# Altium project 智能温控风扇.PrjPCB
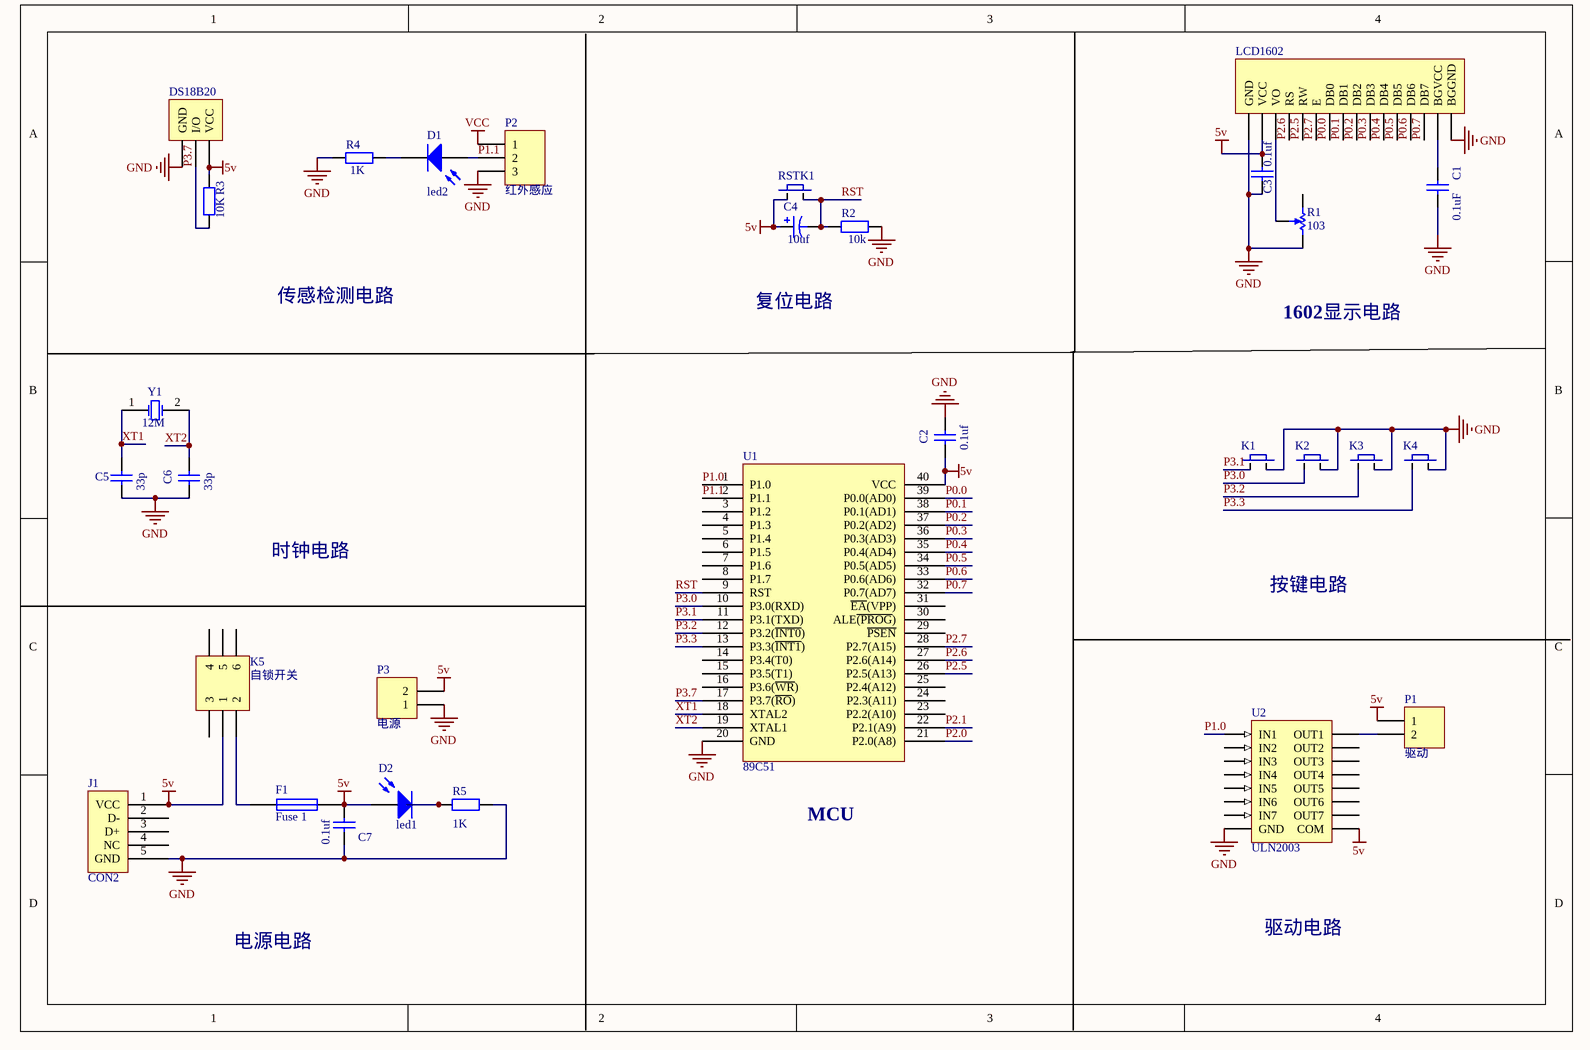
[diagram p0: 智能温控风扇.SchDoc]
1 sheet, 30 parts. Net scope: global (net labels, ports and power ports of the same name join across sheets).

## Sheet 智能温控风扇.SchDoc
size A4

### Parts
C1  value 0.1uF  [CAP-CT4G-0805-5.08MM]  (hidden comment: Cap)
C2  value 0.1uf  [CAP-CT4G-0805-5.08MM]  (hidden comment: Cap)
C3  value 0.1uf  [CAP-CT4G-0805-5.08MM]  (hidden comment: Cap)
C4  value 10uf  [CAP-D4.0XF1.5]  (hidden comment: Cap Pol1)
C5  value 33p  [CAP-CT4G-0805-5.08MM]  (hidden comment: Cap)
C6  value 33p  [CAP-CT4G-0805-5.08MM]  (hidden comment: Cap)
C7  value 0.1uf  [CAP-CT4G-0805-5.08MM]  (hidden comment: Cap)
D1  led2  [LED-5MM-2.54MM]
D2  led1  [LED-5MM-2.54MM]
DS18B20  温度传感器  [HDR1X3]  (value not drawn)
F1  Fuse 1  [PIN-W2/E2.8]
J1  CON2  [MicroUSB1]
K1  轻触按键  [独立按键]  (value not drawn)
K2  轻触按键  [独立按键]  (value not drawn)
K3  轻触按键  [独立按键]  (value not drawn)
K4  轻触按键  [独立按键]  (value not drawn)
K5  自锁开关  [SWICH - duplicate]
LCD1602  舵机  [MHDR1X16]  (value not drawn)
P1  驱动  [HDR1X2]
P2  红外感应  [HDR1X3]
P3  电源  [HDR1X2]
R1  103  [RES-ADJ_3362P]
R2  value 10k  [AXIAL-11.5X4.5(2WS)]  (hidden comment: Res2)
R3  value 10K  [AXIAL-0.4]  (hidden comment: Res2)
R4  value 1K  [AXIAL-0.4]  (hidden comment: Res2)
R5  value 1K  [AXIAL-0.6]  (hidden comment: Res2)
RSTK1  轻触按键  [独立按键]  (value not drawn)
U1  89C51  [89c51]
U2  ULN2003  [PDIP-16]
Y1  12M  [XTAL]

### Nets
5v: C2.1 C3.2 C4.1 C7.1 D2.1(A) DS18B20.3(VCC) F1.2 J1.1(VCC) K5.1 LCD1602.2(VCC) P1.1 P3.2 R3.2 RSTK1.0 U1.40(VCC) U2.2(COM)
GND: C1.1 C2.2 C3.1 C5.1 C6.1 C7.2 DS18B20.1(GND) J1.5(GND) K1.0 K2.0 K3.0 K4.0 LCD1602.1(GND) LCD1602.3(BGGND) P2.3 P3.1 R1.CW(+) R2.2 R4.2 R5.2 U1.20(GND) U2.5(IN3)
VCC: P2.1
P0.0: LCD1602.3(DB0) U1.39(P0.0(AD0))
P0.1: LCD1602.3(DB1) U1.38(P0.1(AD1))
P0.2: LCD1602.3(DB2) U1.37(P0.2(AD2))
P0.3: LCD1602.3(DB3) U1.36(P0.3(AD3))
P0.4: LCD1602.3(DB4) U1.35(P0.4(AD4))
P0.5: LCD1602.3(DB5) U1.34(P0.5(AD5))
P0.6: LCD1602.3(DB6) U1.33(P0.6(AD6))
P0.7: LCD1602.3(DB7) U1.32(P0.7(AD7))
P1.0: U1.1(P1.0) U2.1(IN1)
P1.1: D1.1(A) P2.2 U1.2(P1.1)
P2.0: U1.21(P2.0(A8))
P2.1: U1.22(P2.1(A9))
P2.5: LCD1602.3(RW) U1.26(P2.5(A13))
P2.6: LCD1602.3(RS) U1.27(P2.6(A14))
P2.7: LCD1602.3(E) U1.28(P2.7(A15))
P3.0: K2.0 U1.10(P3.0(RXD))
P3.1: K1.0 U1.11(P3.1(TXD))
P3.2: K3.0 U1.12(P3.2(~{INT0}))
P3.3: K4.0 U1.13(P3.3(~{INT1}))
P3.7: DS18B20.2(I/O) R3.1 U1.17(P3.7(~{RO}))
RST: C4.2 R2.1 RSTK1.0 U1.9(RST)
XT1: C5.2 U1.18(XTAL2) Y1.1(OSC1)
XT2: C6.2 U1.19(XTAL1) Y1.2(OSC2)
NetC1_2: C1.2 LCD1602.3(BGVCC)
NetD1_2: D1.2(K) R4.1
NetD2_2: D2.2(K) R5.1
NetF1_1: F1.1 K5.2
NetLCD1602_3: LCD1602.3(VO) R1.W
NetP1_2: P1.2 U2.2(OUT1)

Not connected (* = marked no-connect by the designer): J1 2(D-) 3(D+) 4(NC); K5 3 4 5 6; R1 CCW(-); U1 3(P1.2) 4(P1.3) 5(P1.4) 6(P1.5) 7(P1.6) 8(P1.7) 14(P3.4(T0)) 15(P3.5(T1)) 16(P3.6(~{WR})) 23(P2.2(A10)) 24(P2.3(A11)) 25(P2.4(A12)) 29(~{PSEN}) 30(ALE~{(PROG})) 31(~{EA}(VPP))

### Notes on the sheet
- 传感检测电路
- 复位电路
- 1602显示电路
- 时钟电路
- 按键电路
- MCU
- 电源电路
- 驱动电路

### Library data of the parts
C1-C3 C5-C7 = Cap: Capacitor; Published: 8-Jun-2000; LatestRevisionDate: 17-Jul-2002; LatestRevisionNote: Re-released for DXP Platform.; PackageReference: RAD-0.3; Publisher: Altium Limited; PackageDescription: Radial Cap, Thru-Hole; 2 Leads; 0.3 in Pin Spacing
C4 = Cap Pol1: Polarized Capacitor (Radial); Published: 8-Jun-2000; LatestRevisionDate: 17-Jul-2002; LatestRevisionNote: Re-released for DXP Platform.; PackageReference: RB7.6-15; Publisher: Altium Limited; PackageDescription: Polarized Capacitor (Radial); 2 Leads
D1 D2 = Photo Sen: Photosensitive Diode; Published: 24-Mar-1999; LatestRevisionDate: 17-Jul-2002; LatestRevisionNote: Re-released for DXP Platform.; PackageReference: PIN2; Publisher: Altium Limited
DS18B20 P2 = Header 3: Header, 3-Pin; LatestRevisionDate: 17-Jul-2002; LatestRevisionNote: Re-released for DXP Platform.; Publisher: Altium Limited
F1 = Fuse 1: Fuse; Published: 8-Jun-2000; LatestRevisionDate: 17-Jul-2002; LatestRevisionNote: Re-released for DXP Platform.; PackageReference: PIN-W2/E2.8; Publisher: Altium Limited; PackageDescription: Thru-Hole; 2 Leads
J1 = CON2_1
K5 = Header 3X2A: Header, 3-Pin, Dual row; LatestRevisionDate: 17-Jul-2002; LatestRevisionNote: Re-released for DXP Platform.; Publisher: Altium Limited
LCD1602 = MHDR1X3: Header, 3-Pin; LatestRevisionDate: 17-Jul-2002; LatestRevisionNote: Re-released for DXP Platform.; Publisher: Altium Limited
P1 P3 = Header 2: Header, 2-Pin; LatestRevisionDate: 17-Jul-2002; LatestRevisionNote: Re-released for DXP Platform.; Publisher: Altium Limited
R1 = RPot SM: Square Trimming Potentiometer; Published: 17-Dec-2003; DatasheetVersion: Oct-2003; PackageReference: POT4MM-2; Publisher: Altium Limited; PackageDescription: Square Trimming Potentiometer; ComponentLink1Description: Manufacturer Link; ComponentLink1URL: http://bourns.com/2/search.html
R2-R5 = Res2: Resistor; Published: 8-Jun-2000; LatestRevisionDate: 17-Jul-2002; LatestRevisionNote: Re-released for DXP Platform.; PackageReference: AXIAL-0.4; Publisher: Altium Limited; PackageDescription: Axial Device, Thru-Hole; 2 Leads; 0.4 in Pin Spacing
U2 = Header 9X2: Header, 9-Pin, Dual row; LatestRevisionDate: 17-Jul-2002; LatestRevisionNote: Re-released for DXP Platform.; Publisher: Altium Limited
Y1 = XTAL: Crystal Oscillator; Published: 8-Jun-2000; LatestRevisionDate: 17-Jul-2002; LatestRevisionNote: Re-released for DXP Platform.; PackageReference: R38; Publisher: Altium Limited; PackageDescription: Crystal, Thru-Hole; 2 Leads; Body 3.1 x 8.2 mm (Dia.xH)